# Altium schematic sheet MotorController.SchDoc
size Letter
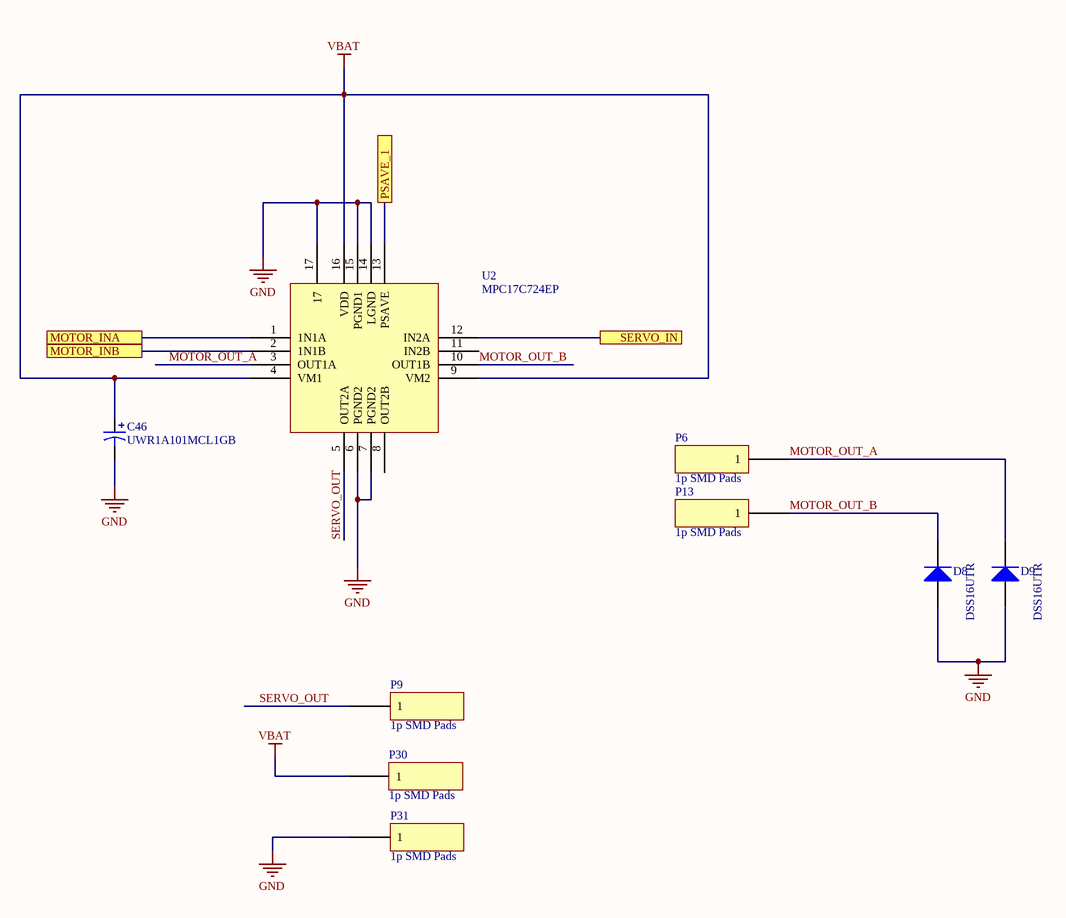
[diagram p0: MotorController.SchDoc]

## Parts
C46  UWR1A101MCL1GB  [UWR1A101MCL1GB]
D8  DSS16UTR  [MCC-SOD-123FL_V]
D9  DSS16UTR  [MCC-SOD-123FL_V]
P6  1p SMD Pads  [1p SMD pad]
P9  1p SMD Pads  [1p SMD pad]
P13  1p SMD Pads  [1p SMD pad]
P30  1p SMD Pads  [1p SMD pad]
P31  1p SMD Pads  [1p SMD pad]
U2  MPC17C724EP  [QFN50P300X300X85_HS-17N]

## Ports
MOTOR_INA, MOTOR_INB, PSAVE_1, SERVO_IN

## Nets
GND: C46.2 D8.1(A) D9.1(A) P31.1 U2.6(PGND2) U2.7(PGND2) U2.14(LGND) U2.15(PGND1) U2.17
VBAT: C46.1 P30.1 U2.4(VM1) U2.9(VM2) U2.16(VDD)
MOTOR_INA: U2.1(1N1A) ; port MOTOR_INA
MOTOR_INB: U2.2(1N1B) ; port MOTOR_INB
MOTOR_OUT_A: D9.2(K) P6.1 U2.3(OUT1A)
MOTOR_OUT_B: D8.2(K) P13.1 U2.10(OUT1B)
PSAVE_1: U2.13(PSAVE) ; port PSAVE_1
SERVO_IN: U2.12(IN2A) ; port SERVO_IN
SERVO_OUT: P9.1 U2.5(OUT2A)

Not connected (* = marked no-connect by the designer): U2 8(OUT2B) 11(IN2B)

## Notes on the sheet
- Title
- Size:
- Date:
- Letter
- Number:
- Time:
- Revision:
- Sheet
- of
- Copyright 2019
- Specialized Solutions LLC
- 206 W Lincoln Hwy STE B
- New Haven, IN 46774
- www.specsolns.com <http://www.specsolns.com>
- File:

## Library data of the parts
C46 = UWR1A101MCL1GB: 100uF Electrolytic
D8 = CMP-2000-07084-1: SCHOTTKY 60V SOD-123FL; Manufacturer: Micro Commercial Components; Diode Configuration: Single; Diode Type: StandardRecovery; Forward Surge Current Ifsm Max: 30A; Forward Current If(AV): 1A; Forward Voltage VF Max: 1.1V; Repetitive Reverse Voltage Vrrm Max: 1kV; Manufacturer URL: http://www.mccsemi.com/; Datasheet URL: http://www.mccsemi.com/up_pdf/SM4001PL-SM4007PL(SOD-123FL).PDF; Package Description: 2-Pin Small Outline Diode, Flat Lead, Body 2.825 x 1.65 mm; Datasheet Version: Rev. H, 05/2015; Package Reference: SOD-123FL; Mounting Technology: SurfaceMount
D9 = CMP-2000-07084-1: SCHOTTKY 60V SOD-123FL Reel; Manufacturer: Micro Commercial Components; Diode Configuration: Single; Diode Type: StandardRecovery; Forward Surge Current Ifsm Max: 30A; Forward Current If(AV): 1A; Forward Voltage VF Max: 1.1V; Repetitive Reverse Voltage Vrrm Max: 1kV; Manufacturer URL: http://www.mccsemi.com/; Datasheet URL: http://www.mccsemi.com/up_pdf/SM4001PL-SM4007PL(SOD-123FL).PDF; Package Description: 2-Pin Small Outline Diode, Flat Lead, Body 2.825 x 1.65 mm; Datasheet Version: Rev. H, 05/2015; Package Reference: SOD-123FL; Mounting Technology: SurfaceMount
P6 P9 P13 P30 P31 = 1p SMD
U2 = MPC17C724EP: 0.4 A Dual H-Bridge Motor Driver